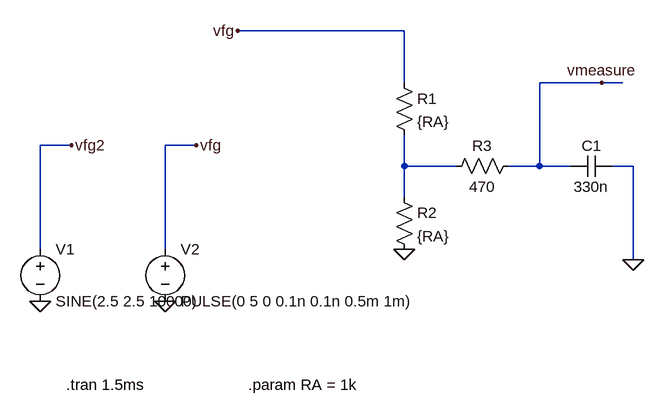
[diagram p0: schematic RC_Circuit_pulse_sine.asc]
RC_Circuit_pulse_sine.asc, the LTspice schematic file:
Version 4
SHEET 1 984 680
WIRE 608 -96 352 -96
WIRE 608 -16 608 -96
WIRE 912 -16 816 -16
WIRE 944 -16 912 -16
WIRE 96 80 48 80
WIRE 288 80 240 80
WIRE 608 112 608 64
WIRE 688 112 608 112
WIRE 816 112 816 -16
WIRE 816 112 768 112
WIRE 864 112 816 112
WIRE 960 112 928 112
WIRE 608 160 608 112
WIRE 48 240 48 80
WIRE 240 240 240 80
WIRE 960 256 960 112
FLAG 48 320 0
FLAG 240 320 0
FLAG 608 240 0
FLAG 960 256 0
FLAG 912 -16 vmeasure
FLAG 352 -96 vfg
FLAG 96 80 vfg2
FLAG 288 80 vfg
SYMBOL voltage 48 224 R0
WINDOW 123 0 0 Left 0
WINDOW 39 0 0 Left 0
SYMATTR InstName V1
SYMATTR Value SINE(2.5 2.5 10000)
SYMBOL voltage 240 224 R0
WINDOW 123 0 0 Left 0
WINDOW 39 0 0 Left 0
SYMATTR InstName V2
SYMATTR Value PULSE(0 5 0 0.1n 0.1n 0.5m 1m)
SYMBOL res 592 -32 R0
SYMATTR InstName R1
SYMATTR Value {RA}
SYMBOL res 592 144 R0
SYMATTR InstName R2
SYMATTR Value {RA}
SYMBOL res 784 96 R90
WINDOW 0 0 56 VBottom 2
WINDOW 3 32 56 VTop 2
SYMATTR InstName R3
SYMATTR Value 470
SYMBOL cap 928 96 R90
WINDOW 0 0 32 VBottom 2
WINDOW 3 32 32 VTop 2
SYMATTR InstName C1
SYMATTR Value 330n
TEXT 88 448 Left 2 !.tran 1.5ms
TEXT 368 448 Left 2 !.param RA = 1k

The netlist it stands for:
* RC_Circuit_pulse_sine.asc
V1 vfg2 0 SINE(2.5 2.5 10000)
V2 vfg 0 PULSE(0 5 0 0.1n 0.1n 0.5m 1m)
R1 vfg N001 {RA}
R2 N001 0 {RA}
R3 vmeasure N001 470
C1 0 vmeasure 330n
.tran 1.5ms
.param RA = 1k
.backanno
.end